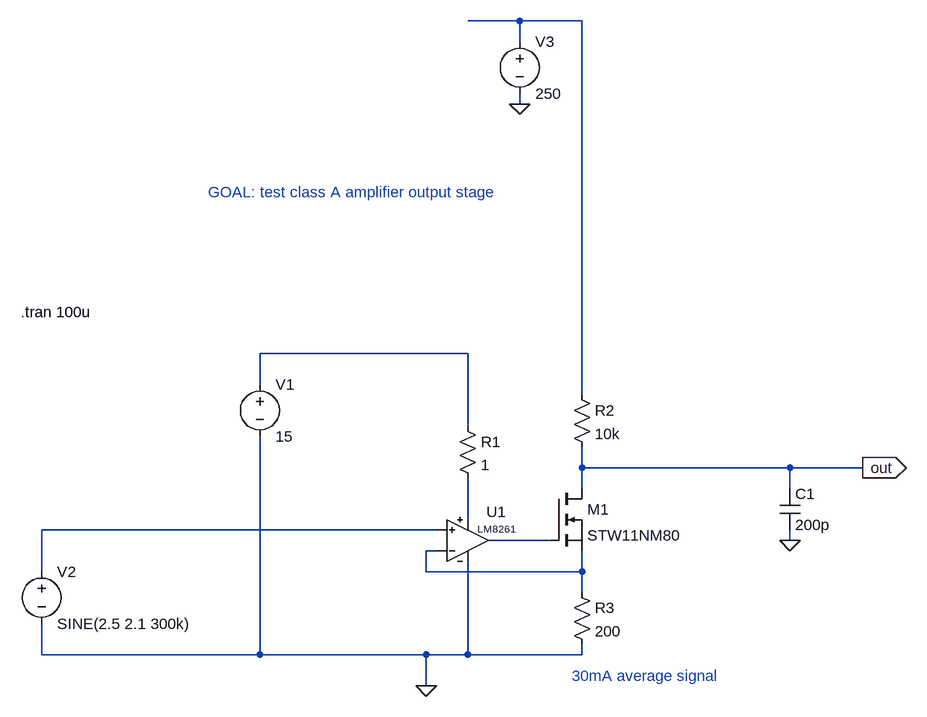
[diagram p0: schematic class-a-amplifier-test.asc]
class-a-amplifier-test.asc, the LTspice schematic file:
Version 4
SHEET 1 1108 680
WIRE 192 -640 112 -640
WIRE 288 -640 192 -640
WIRE 192 -608 192 -640
WIRE 192 -512 192 -528
WIRE 112 -128 -208 -128
WIRE -208 -80 -208 -128
WIRE 288 -64 288 -640
WIRE 112 -16 112 -128
WIRE 288 48 288 16
WIRE 608 48 288 48
WIRE 720 48 608 48
WIRE 288 80 288 48
WIRE 608 80 608 48
WIRE 112 128 112 64
WIRE 64 144 -544 144
WIRE 240 160 144 160
WIRE 608 160 608 144
WIRE 64 176 48 176
WIRE -544 208 -544 144
WIRE 48 208 48 176
WIRE 288 208 288 176
WIRE 288 208 48 208
WIRE 288 240 288 208
WIRE -544 336 -544 288
WIRE -208 336 -208 0
WIRE -208 336 -544 336
WIRE 48 336 -208 336
WIRE 112 336 112 192
WIRE 112 336 48 336
WIRE 288 336 288 320
WIRE 288 336 112 336
WIRE 48 384 48 336
FLAG 192 -512 0
FLAG 720 48 out
IOPIN 720 48 Out
FLAG 48 384 0
FLAG 608 160 0
SYMBOL LM8261 112 160 R0
SYMATTR InstName U1
SYMBOL nmos 240 80 R0
SYMATTR InstName M1
SYMATTR Value STW11NM80
SYMBOL res 272 224 R0
SYMATTR InstName R3
SYMATTR Value 200
SYMBOL res 272 -80 R0
SYMATTR InstName R2
SYMATTR Value 10k
SYMBOL voltage 192 -624 R0
WINDOW 123 0 0 Left 0
WINDOW 39 0 0 Left 0
SYMATTR InstName V3
SYMATTR Value 250
SYMBOL voltage -544 192 R0
WINDOW 123 0 0 Left 0
WINDOW 39 0 0 Left 0
SYMATTR InstName V2
SYMATTR Value SINE(2.5 2.1 300k)
SYMBOL voltage -208 -96 R0
WINDOW 123 0 0 Left 0
WINDOW 39 0 0 Left 0
SYMATTR InstName V1
SYMATTR Value 15
SYMBOL res 96 -32 R0
SYMATTR InstName R1
SYMATTR Value 1
SYMBOL cap 592 80 R0
SYMATTR InstName C1
SYMATTR Value 200p
TEXT -576 -192 Left 2 !.tran 100u
TEXT 272 368 Left 2 ;30mA average signal
TEXT -288 -376 Left 2 ;GOAL: test class A amplifier output stage

The netlist it stands for:
* class-a-amplifier-test.asc
XU1 N004 N006 N003 0 N005 LM8261  ; pins 3 2 7 4 6
M1 out N005 N006 N006 STW11NM80
R3 N006 0 200
R2 N001 out 10k
V3 N001 0 250
V2 N004 0 SINE(2.5 2.1 300k)
V1 N002 0 15
R1 N002 N003 1
C1 out 0 200p
.model NMOS NMOS
.model PMOS PMOS
.lib standard.mos
.tran 100u
* 30mA average signal
* GOAL: test class A amplifier output stage
.lib LM8261.MOD
.backanno
.end